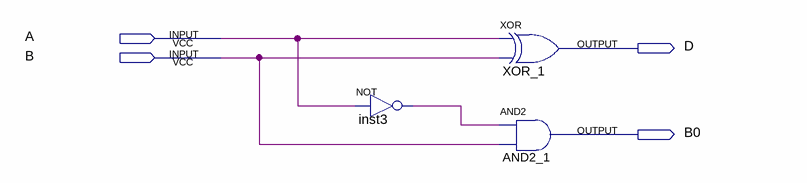
[diagram p0: schematic sheet]
// Quartus schematic Half_Subtractor.bdf as structural Verilog: 3 symbols, 4 pins
module Half_Subtractor (
  input  A,
  input  B,
  output D,
  output B0
);

  wire inst3_out;

  not inst3 (inst3_out, A);
  xor XOR_1 (D, A, B);
  and AND2_1 (B0, inst3_out, B);
endmodule
